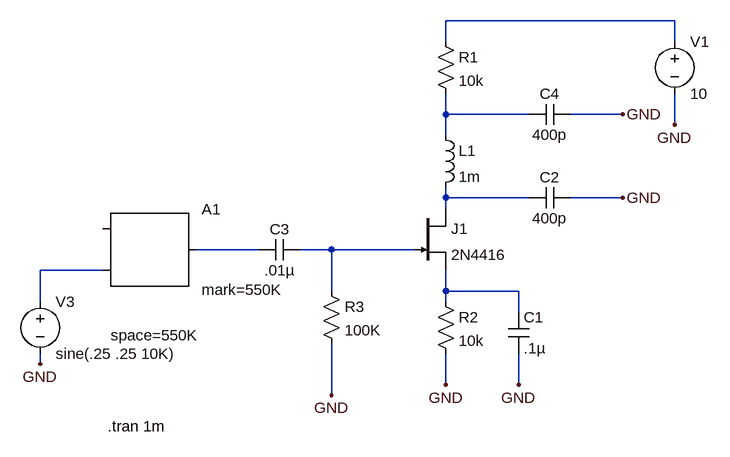
[diagram p0: schematic AMdet.asc]
AMdet.asc, the LTspice schematic file:
Version 4
SHEET 1 940 704
WIRE 528 352 528 336
WIRE 528 240 528 208
WIRE 880 224 880 176
WIRE 880 96 880 64
WIRE 880 64 528 64
WIRE 528 624 528 576
WIRE 528 96 528 64
WIRE 528 496 528 480
WIRE 528 480 640 480
WIRE 528 480 528 448
WIRE 640 480 640 512
WIRE 640 576 640 624
WIRE 480 416 352 416
WIRE 352 416 352 480
WIRE 352 560 352 640
WIRE 352 416 304 416
WIRE 240 416 144 416
WIRE -96 576 -96 592
WIRE 0 448 -96 448
WIRE -96 448 -96 496
WIRE 528 208 656 208
WIRE 720 208 800 208
WIRE 528 208 528 176
WIRE 800 336 720 336
WIRE 656 336 528 336
WIRE 528 336 528 320
FLAG 528 624 GND
FLAG 880 224 GND
FLAG 640 624 GND
FLAG 352 640 GND
FLAG -96 592 GND
FLAG 800 336 GND
FLAG 800 208 GND
SYMBOL ind 512 224 R0
SYMATTR InstName L1
SYMATTR Value 1m
SYMBOL voltage 880 80 R0
SYMATTR InstName V1
SYMATTR Value 10
SYMBOL res 512 80 R0
SYMATTR InstName R1
SYMATTR Value 10k
SYMBOL res 512 480 R0
SYMATTR InstName R2
SYMATTR Value 10k
SYMBOL cap 624 512 R0
SYMATTR InstName C1
SYMATTR Value .1µ
SYMBOL res 336 464 R0
SYMATTR InstName R3
SYMATTR Value 100K
SYMBOL cap 304 400 R90
WINDOW 0 0 32 VBottom 0
WINDOW 3 32 32 VTop 0
SYMATTR InstName C3
SYMATTR Value .01µ
SYMBOL SpecialFunctions\modulate 0 384 R0
WINDOW 123 12 164 Left 0
SYMATTR InstName A1
SYMATTR Value mark=550K
SYMATTR Value2 space=550K
SYMBOL voltage -96 480 R0
SYMATTR InstName V3
SYMATTR Value sine(.25 .25 10K)
SYMBOL cap 720 320 R90
WINDOW 0 0 32 VBottom 0
WINDOW 3 32 32 VTop 0
SYMATTR InstName C2
SYMATTR Value 400p
SYMBOL cap 720 192 R90
WINDOW 0 0 32 VBottom 0
WINDOW 3 32 32 VTop 0
SYMATTR InstName C4
SYMATTR Value 400p
SYMBOL njf 480 352 R0
SYMATTR InstName J1
SYMATTR Value 2N4416
text 8 688 Left 0 !.tran 1m

The netlist it stands for:
* AMdet.asc
L1 N002 N001 1m
V1 N003 GND 10
R1 N003 N002 10k
R2 N004 GND 10k
C1 N004 GND .1µ
R3 N005 GND 100K
C3 N005 N006 .01µ
A1 0 N007 0 0 0 0 N006 0 MODULATOR mark=550K space=550K
V3 N007 GND sine(.25 .25 10K)
C2 GND N001 400p
C4 GND N002 400p
J1 N001 N005 N004 2N4416
.model NJF NJF
.model PJF PJF
.lib standard.jft
.tran 1m
.backanno
.end